# Altium schematic sheet voltage_sensing.SchDoc
size Letter; DrawnBy: Robson Souza; SheetNumber: 5; SheetTotal: 9
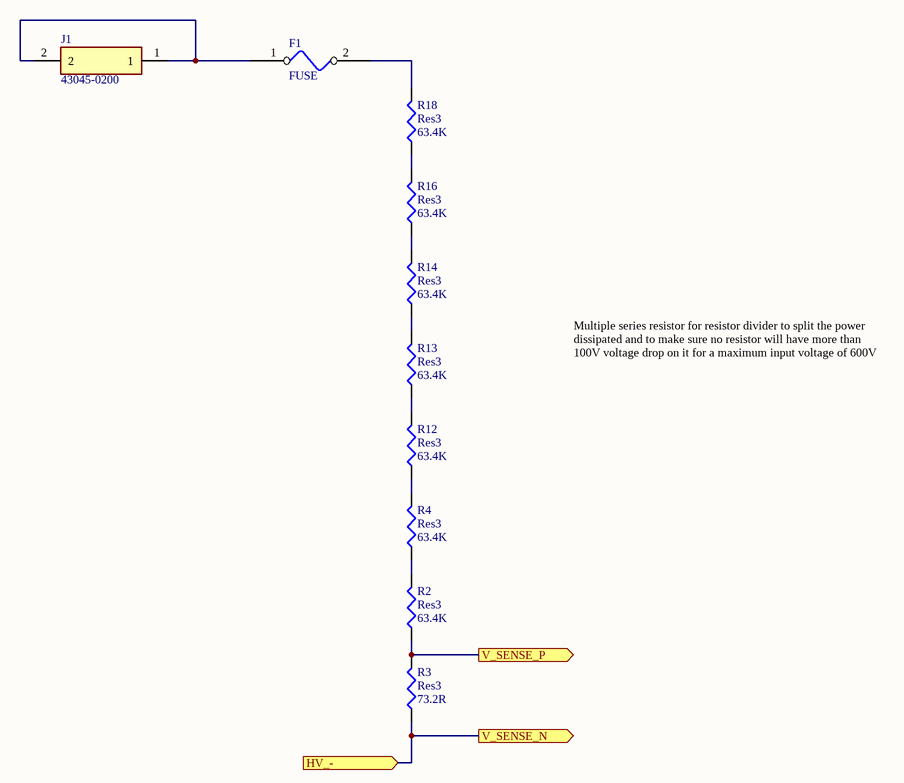
[diagram p0: voltage_sensing.SchDoc]

## Parts
F1  FUSE  [12Z-2010]
J1  43045-0200  [MOLEX_43045-0200]
R2  Res3  value 63.4K  [RESC2112X05M]
R3  Res3  value 73.2R  [RESC2112X05M]
R4  Res3  value 63.4K  [RESC2112X05M]
R12  Res3  value 63.4K  [RESC2112X05M]
R13  Res3  value 63.4K  [RESC2112X05M]
R14  Res3  value 63.4K  [RESC2112X05M]
R16  Res3  value 63.4K  [RESC2112X05M]
R18  Res3  value 63.4K  [RESC2112X05M]

## Ports
HV_- (in), V_SENSE_N (out), V_SENSE_P (out)

## Nets
HV_-: R3.1 ; port V_SENSE_N, port HV_-
V_SENSE_P: R2.1 R3.2 ; port V_SENSE_P
NetF1_1: F1.1 J1.1 J1.2
NetF1_2: F1.2 R18.2
NetR2_2: R2.2 R4.1
NetR4_2: R4.2 R12.1
NetR12_2: R12.2 R13.1
NetR13_2: R13.2 R14.1
NetR14_2: R14.2 R16.1
NetR16_2: R16.2 R18.1

## Notes on the sheet
- Multiple series resistor for resistor divider to split the power dissipated and to make sure no resistor will have more than 100V voltage drop on it for a maximum input voltage of 600V

## Library data of the parts
J1 = 43045-0200: Connector Header Through Hole, Right Angle 2 position -; MF: Molex; Digi-Key_Part_Number: WM1813-ND; SnapEDA_Link: https://www.snapeda.com/parts/43045-0200/Molex/view-part/?ref=snap; Purchase-URL: https://pricing.snapeda.com/search/part/43045-0200/?ref=eda; Package: None; MP: 43045-0200; Check_prices: https://www.snapeda.com/parts/43045-0200/Molex/view-part/?ref=eda; Value: 43045-0200
R2 R4 R12-R14 R16 R18 = Resistor_63.4K: RES SMD 63.4K OHM 1% 1/8W 0805; MPN: CRCW080563K4FKEA; PN: 541-63.4KCCT-ND; Name: Resistor_63.4K; URL: http://www.digikey.ca/product-detail/en/CRCW080563K4FKEA/541-63.4KCCT-ND
R3 = Resistor_73.2R: RES SMD 73.2R OHM 1% 1/8W 0805; MPN: CRCW080573R2FKEA; PN: 541-73.2CCT-ND; Name: Resistor_73.2R; URL: http://www.digikey.ca/product-detail/en/CRCW080573R2FKEA/541-73.2CCT-ND